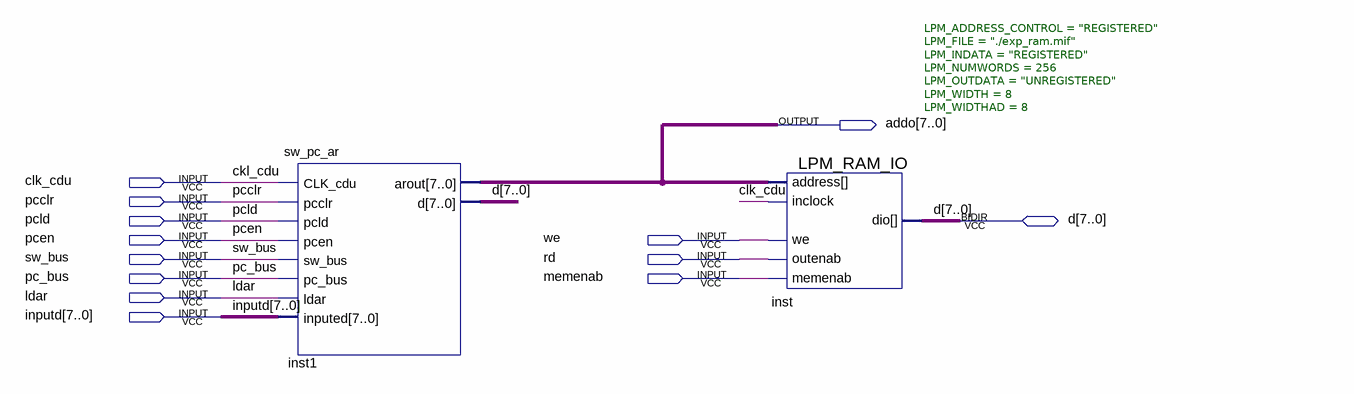
[diagram p0: schematic sheet]
// Quartus schematic pc_ram.bdf as structural Verilog: 2 symbols, 13 pins
module pc_ram (
  input  clk_cdu,
  input  pcclr,
  input  pcld,
  input  pcen,
  input  we,
  input  sw_bus,
  input  rd,
  input  pc_bus,
  input  memenab,
  input  ldar,
  input  [7:0] inputd,
  inout  [7:0] d,
  output [7:0] addo
);

  sw_pc_ar inst1 (
    .CLK_cdu(clk_cdu), .pcclr(pcclr), .pcld(pcld), .pcen(pcen), .sw_bus(sw_bus), .pc_bus(pc_bus),
    .ldar(ldar), .inputed(inputd), .arout(addo), .d(d));
  LPM_RAM_IO #(.LPM_ADDRESS_CONTROL("REGISTERED"), .LPM_FILE("./exp_ram.mif"), .LPM_INDATA("REGISTERED"), .LPM_NUMWORDS(256), .LPM_OUTDATA("UNREGISTERED"), .LPM_WIDTH(8), .LPM_WIDTHAD(8)) inst (
    .address(addo), .memenab(memenab), .inclock(clk_cdu), .we(we), .outenab(rd), .dio(d));

  // Other names for the same wires on the sheet: ckl_cdu = clk_cdu
endmodule
